# Altium schematic sheet SimPL_IMU_v1_0 _OCT31.SchDoc
size C
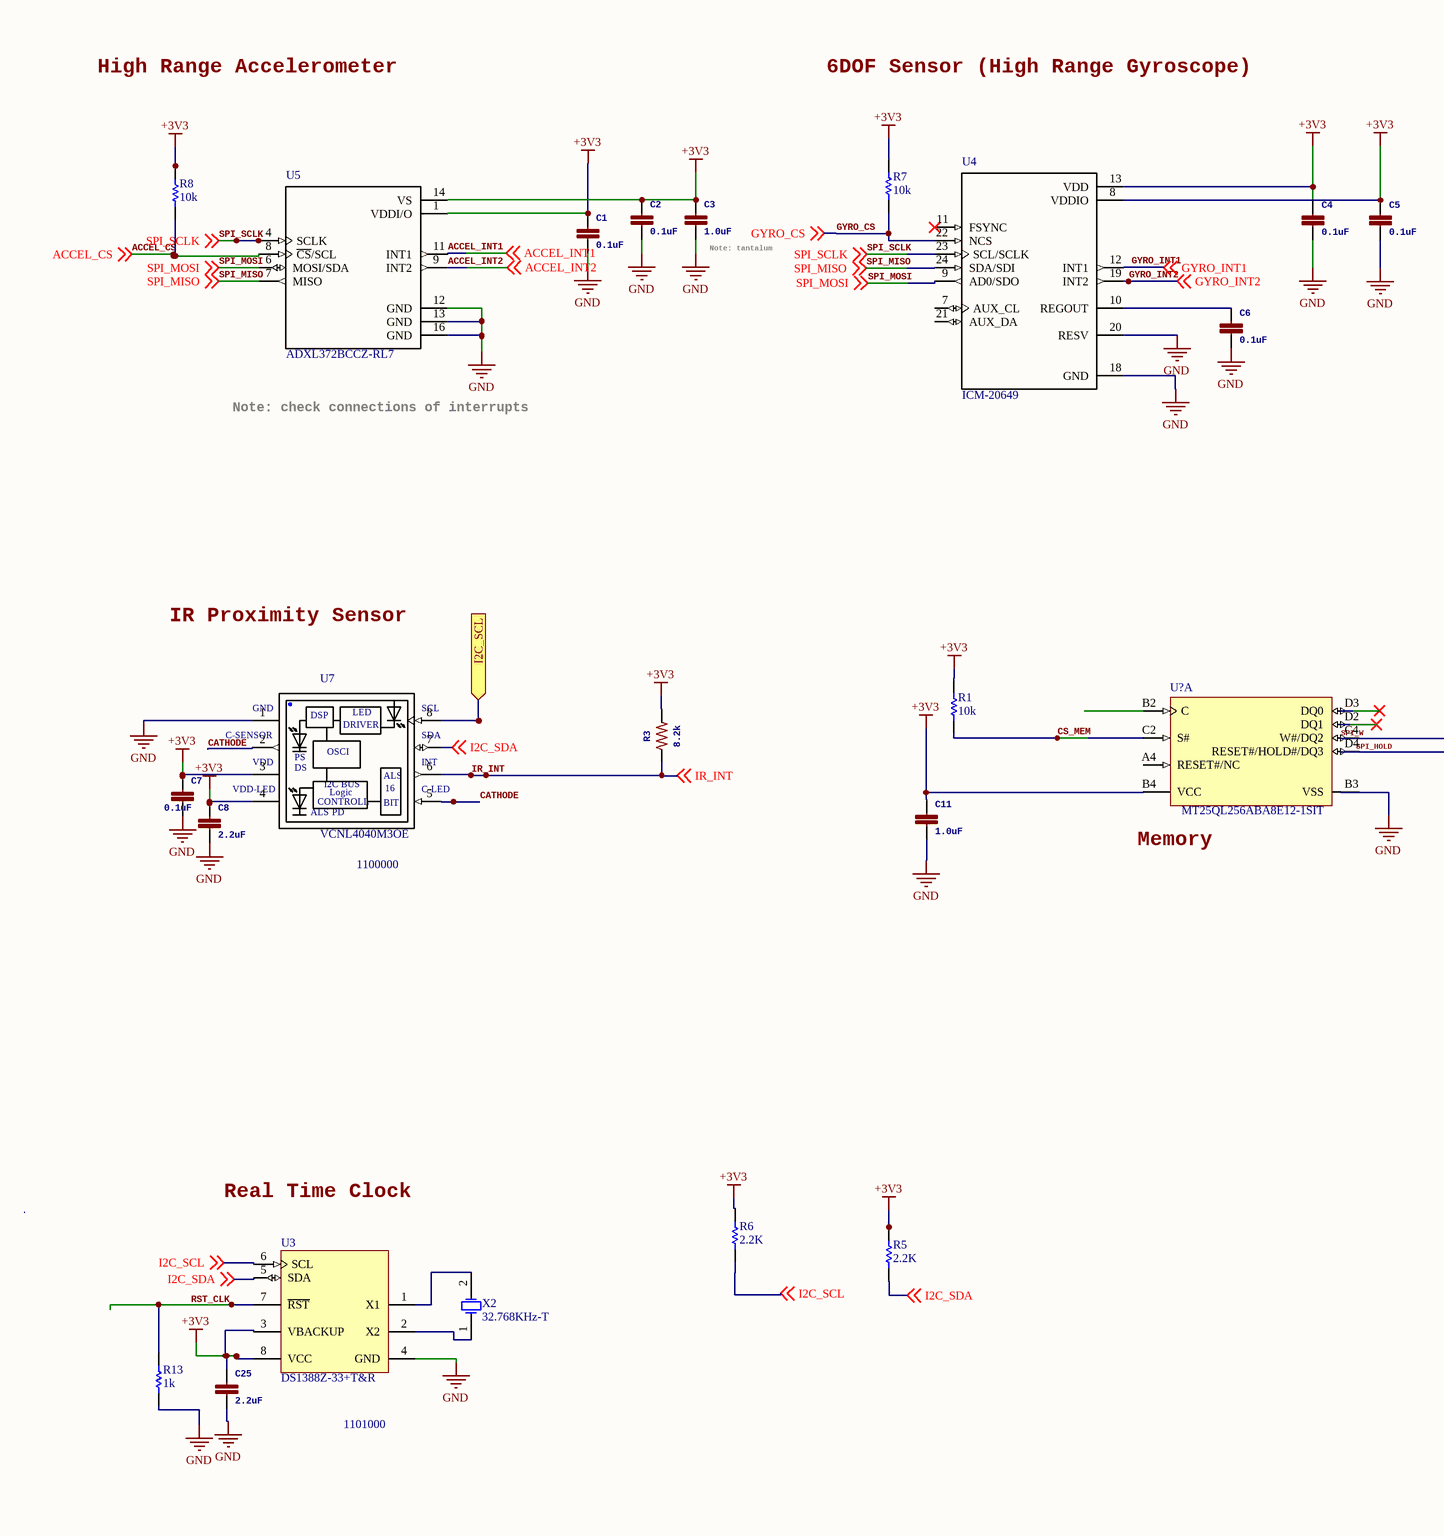
[diagram p0: SimPL_IMU_v1_0 _OCT31.SchDoc, left]
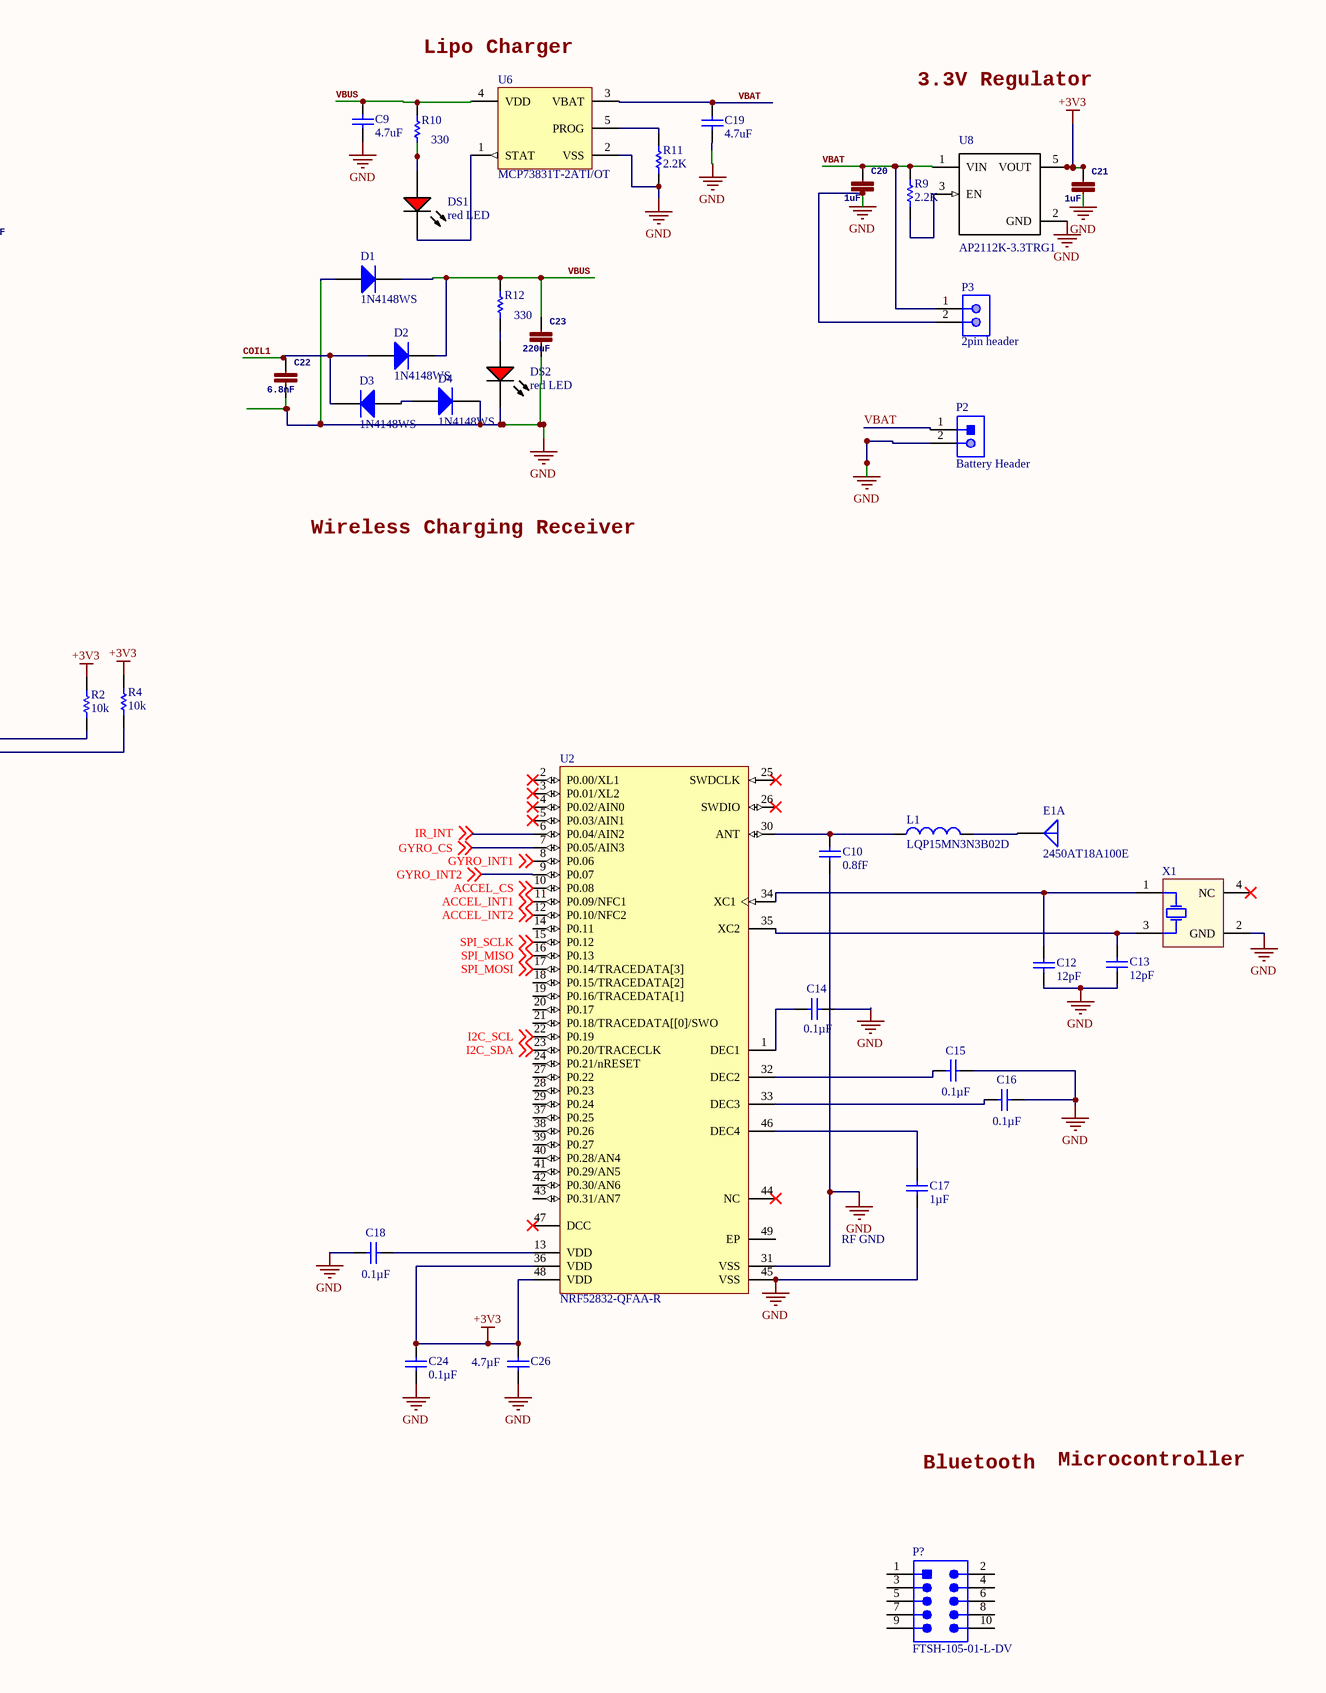
[diagram p1: SimPL_IMU_v1_0 _OCT31.SchDoc, right]

## Parts
C1  0.1uF  [0402]
C2  0.1uF  [0402]
C3  1.0uF  [0402]
C4  0.1uF  [0402]
C5  0.1uF  [0402]
C6  0.1uF  [0402]
C7  0.1uF  [0402]
C8  2.2uF  [0402]
C9  4.7uF  [CAPC1005X65X10ML15]
C10  value 0.8fF  [CAPC0603X28X15LL05T05]  (hidden comment: 02013J0R8BBSTR)
C11  1.0uF  [0402]
C12  value 12pF  [CAPC0402(1005)60_N]  (hidden comment: CAP 12pF 16V 0402(1005))
C13  value 12pF  [CAPC0402(1005)60_N]  (hidden comment: CAP 12pF 16V 0402(1005))
C14  Capacitance: 0.1µF  [CAPC1005X55X10LL05]  (hidden comment: CGA2B3X7R1E104K050BB)
C15  Capacitance: 0.1µF  [CAPC1005X55X10LL05]  (hidden comment: CGA2B3X7R1E104K050BB)
C16  Capacitance: 0.1µF  [CAPC1005X55X10LL05]  (hidden comment: CGA2B3X7R1E104K050BB)
C17  Capacitance: 1µF  [CAPC1005X55X10LL05]  (hidden comment: C1005X5R1V105K050BC)
C18  Capacitance: 0.1µF  [CAPC1005X55X10LL05]  (hidden comment: CGA2B3X7R1E104K050BB)
C19  4.7uF  [CAPC1005X65X10ML15]
C20  1uF  [0402]
C21  1uF  [0402]
C22  6.8nF  [0402]
C23  220uF  [0402]
C24  Capacitance: 0.1µF  [CAPC1005X55X10LL05]  (hidden comment: CGA2B3X7R1E104K050BB)
C25  2.2uF  [0402]
C26  Capacitance: 4.7µF  [CAPC1005X65X10ML15]  (hidden comment: C1005X5R1A475M050BC)
D1  1N4148WS  [DIOD-SOD323-2-A_V]
D2  1N4148WS  [DIOD-SOD323-2-A_V]
D3  1N4148WS  [DIOD-SOD323-2-A_V]
D4  1N4148WS  [DIOD-SOD323-2-A_V]
DS1  red LED  [VISH-TLMS1000_V]
DS2  red LED  [VISH-TLMS1000_V]
E1  2450AT18A100E  [JT-2450AT18A100-2_V]  (part A of 2)
L1  LQP15MN3N3B02D  [INDC1005X45X25LL10T10]
P2  Battery Header  [JST-S2B-PH-K-S_V]
P3  2pin header  [AMPH-68000-102HLF_V]
P?  FTSH-105-01-L-DV  [SMTC-FTSH-105-01-L-DV_V]
R1  10k  [RESC1005X40X25NL05T05]
R2  10k  [RESC1005X40X25NL05T05]
R3  8.2k  [0603]
R4  10k  [RESC1005X40X25NL05T05]
R5  2.2K  [RESC1005X40X25ML10T10]
R6  2.2K  [RESC1005X40X25ML10T10]
R7  10k  [RESC1005X40X25NL05T05]
R8  10k  [RESC1005X40X25NL05T05]
R9  2.2K  [RESC1005X40X25ML10T10]
R10  330  [RESC2013X50X30NL20T20]
R11  2.2K  [RESC1005X40X25ML10T10]
R12  330  [RESC2013X50X30NL20T20]
R13  1k  [RESC1005X40X25NL05T05]
U2  NRF52832-QFAA-R  [NRSC-QF-48_M]
U3  DS1388Z-33+T&R  [S8+4_M]
U4  ICM-20649  [*QFN40P300X300X95-24N]
U5  ADXL372BCCZ-RL7  [*PQFN50P322X300X114-16N]
U6  MCP73831T-2ATI/OT  [SOT-23-OT5_M]
U7  VCNL4040M3OE  [*VISHAY_VCNL4040_4X2X1.1]
U8  AP2112K-3.3TRG1  [*SOT95P285X140-5N]
U?  MT25QL256ABA8E12-1SIT  [*SON127P600X800X80-9N]  (part A of 2)
X1  CX2520DB32000D0GEJZ1  [AVX-CX2520DB32000D0GEJZ1-4_V]  (value not drawn)
X2  32.768KHz-T  [ABRA-ABS07-2_V]

## Ports
I2C_SCL (in)

## Nets
+3V3: C1.1 C2.1 C3.1 C4.1 C5.1 C7.1 C8.1 C11.1 C21.1 C24.2 C25.1 C26.2 R1.2 R2.2 R3.2 R4.2 R5.2 R6.2 R7.2 R8.2 U2.36(VDD) U2.48(VDD) U3.3(VBACKUP) U3.8(VCC) U4.8(VDDIO) U4.13(VDD) U5.1(VDDI/O) U5.14(VS) U7.3(VDD) U7.4(VDD-LED) U8.5(VOUT) U?.B4(VCC)
GND: C1.2 C2.2 C3.2 C4.2 C5.2 C6.2 C7.2 C8.2 C9.1 C10.1 C11.2 C12.1 C13.1 C14.2 C15.2 C16.2 C17.1 C18.1 C19.1 C20.2 C21.2 C22.2 C23.2 C24.1 C25.2 C26.1 D1.1(A) D4.2(K) DS2.2(K) P2.2 P3.2 R11.1 R13.1 U2.31(VSS) U2.45(VSS) U3.4(GND) U4.18(GND) U4.20(RESV) U5.12(GND) U5.13(GND) U5.16(GND) U6.2(VSS) U7.1(GND) U8.2(GND) X1.2(GND)
ACCEL_CS: R8.1 U2.10(P0.08) U5.8(~{CS}/SCL) ; off-sheet ACCEL_CS
ACCEL_INT1: U2.11(P0.09/NFC1) U5.11(INT1) ; off-sheet ACCEL_INT1
ACCEL_INT2: U2.12(P0.10/NFC2) U5.9(INT2) ; off-sheet ACCEL_INT2
CATHODE: U7.2(C-SENSOR) U7.5(C-LED)
COIL1: C22.1 D2.1(A) D3.2(K)
CS_MEM: R1.1 U?.C2(S#)
GYRO_CS: R7.1 U2.7(P0.05/AIN3) U4.22(NCS) ; off-sheet GYRO_CS
GYRO_INT1: U2.8(P0.06) U4.12(INT1) ; off-sheet GYRO_INT1
GYRO_INT2: U2.9(P0.07) U4.19(INT2) ; off-sheet GYRO_INT2
I2C_SCL: U7.8(SCL) ; port I2C_SCL
I2C_SCL: R6.1 U2.22(P0.19) U3.6(SCL) ; off-sheet I2C_SCL  [a separate net that carries the same name]
I2C_SDA: R5.1 U2.23(P0.20/TRACECLK) U3.5(SDA) U7.7(SDA) ; off-sheet I2C_SDA
IR_INT: R3.1 U2.6(P0.04/AIN2) U7.6(INT) ; off-sheet IR_INT
SPI_HOLD: R4.1
SPI_MISO: U2.16(P0.13) U4.24(SDA/SDI) U5.7(MISO) ; off-sheet SPI_MISO
SPI_MOSI: U2.17(P0.14/TRACEDATA[3]) U4.9(AD0/SDO) U5.6(MOSI/SDA) ; off-sheet SPI_MOSI
SPI_SCLK: U2.15(P0.12) U4.23(SCL/SCLK) U5.4(SCLK) ; off-sheet SPI_SCLK
SPI_W: R2.1
VBAT: C19.2 C20.1 P2.1 P3.1 R9.2 U6.3(VBAT) U8.1(VIN)
VBUS: C9.2 C23.1 D1.2(K) D2.2(K) R10.2 R12.2 U6.4(VDD)
NetC6_1: C6.1 U4.10(REGOUT)
NetC10_2: C10.2 L1.1 U2.30(ANT)
NetC12_2: C12.2 U2.34(XC1) X1.1(HOT)
NetC13_2: C13.2 U2.35(XC2) X1.3(HOT)
NetC14_1: C14.1 U2.1(DEC1)
NetC15_1: C15.1 U2.32(DEC2)
NetC16_1: C16.1 U2.33(DEC3)
NetC17_2: C17.2 U2.46(DEC4)
NetC18_2: C18.2 U2.13(VDD)
NetD3_1: D3.1(A) D4.1(A)
NetDS1_1: DS1.1(A) R10.1
NetDS1_2: DS1.2(K) U6.1(STAT)
NetDS2_1: DS2.1(A) R12.1
NetE1_1: E1.1(FP) L1.2
NetR9_1: R9.1 U8.3(EN)
NetR11_2: R11.2 U6.5(PROG)
NetR13_2: R13.2 U3.7(~{RST})
NetU3_1: U3.1(X1) X2.2(X2)
NetU3_2: U3.2(X2) X2.1(X2)

Not connected (* = marked no-connect by the designer): P? 1 2 3 4 5 6 7 8 9 10; U2 2(P0.00/XL1)* 3(P0.01/XL2)* 4(P0.02/AIN0)* 5(P0.03/AIN1)* 14(P0.11) 18(P0.15/TRACEDATA[2]) 19(P0.16/TRACEDATA[1]) 20(P0.17) 21(P0.18/TRACEDATA[[0]/SWO) 24(P0.21/nRESET) 25(SWDCLK)* 26(SWDIO)* 27(P0.22) 28(P0.23) 29(P0.24) 37(P0.25) 38(P0.26) 39(P0.27) 40(P0.28/AN4) 41(P0.29/AN5) 42(P0.30/AN6) 43(P0.31/AN7) 44(NC)* 47(DCC)* 49(EP); U4 7(AUX_CL) 11(FSYNC)* 21(AUX_DA); U? A4(RESET#/NC) B2(C) B3(VSS) C4(W#/DQ2) D2(DQ1)* D3(DQ0)* D4(RESET#/HOLD#/DQ3); X1 4(NC)*

## Notes on the sheet
- High Range Accelerometer
- 6DOF Sensor (High Range Gyroscope)
- Lipo Charger
- 3.3V Regulator
- (near C3) Note: tantalum
- Note: check connections of interrupts
- Wireless Charging Receiver
- IR Proximity Sensor
- 1100000
- (near U?) Memory
- Real Time Clock
- RF GND
- 1101000
- Bluetooth
- Microcontroller
- Labels drawn without touching a wire or pin: RST_CLK
- (in symbol VCNL4040M3OE) LED; DSP; DRIVER; OSCI; PS; DS; ALS; I2C BUS; Logic; 16; CONTROLL; BIT; PD

## Library data of the parts
C1 C2 C4-C7 = 0.1UF-0402-16V-10%: 0.1ÂµF ceramic capacitors    A capacitor is a passive two-terminal electrical component used to store electrical energy temporarily in an electric field.; GateName_1: G$1; SymbolName_1: CAP; PROD_ID: CAP-12416; DeviceName: -0402-16V-10%; LibraryName: SparkFun-Capacitors; DeviceSetName: 0.1UF
C3 = 1.0UF-0402-16V-10%: 1ÂµF ceramic capacitors    A capacitor is a passive two-terminal electrical component used to store electrical energy temporarily in an electric field.; GateName_1: G$1; SymbolName_1: CAP; PROD_ID: CAP-12417; DeviceName: -0402-16V-10%; LibraryName: SparkFun-Capacitors; DeviceSetName: 1.0UF
C8 C20-C23 C25 = 0.1UF-0402-16V-10%: 0.1ÂµF ceramic capacitors    A capacitor is a passive two-terminal electrical component used to store electrical energy temporarily in an electric field.; GateName_1: G$1; SymbolName_1: CAP; DeviceSetName: 0.1UF; PROD_ID: CAP-12416; DeviceName: -0402-16V-10%; LibraryName: SparkFun-Capacitors
C9 C19 = CMP-2000-05438-1: Chip Capacitor, 4.7 uF, +/- 20%, 10 V, -55 to 85 degC, 0402 (1005 Metric), RoHS, Tape and Reel; PCN Part Number: MLCCPartNumberChange30/Nov/2012; Manufacturer: TDK; Other Names: 445-8023-1; Voltage - Rated: 10V; Temperature Coefficient: X5R; Online Catalog: CSeries,GeneralPurpose; Capacitance: 4.7µF; Kits: 445-9021-KIT-ND-KITMLCC100PF-10UF04026.3-50V445-9003-KIT-ND-KITCAPCERHICAPMLCCSMD; Product Training Modules: CSeriesGeneralApplicationsSEAT,CCV,andTVCLDesignToolsGuidetoReplacinganElectrolyticCapacitorwithanMLCC; Lead Style: -; Datasheet Version: Sep-13; Category: Capacitors; Operating Temperature: -55degC~85degC; Applications: GeneralPurpose; Standard Package: 1; RoHS Information: RoHSCertificate-MLCC; Series: C; Datasheet URL: https://datasheet.ciiva.com/24216/c1005x5r1a475m050bc-264317-24216438.pdf; Package / Case: 0402(1005Metric); Mounting Type: SurfaceMount,MLCC; Ratings: -; Tolerance: ±20%; Lead Spacing: -; Height - Seated (Max): -; Manufacturer URL: http://www.tdk.com/; Size / Dimension: 0.039"Lx0.020"W(1.00mmx0.50mm); Packaging: CutTape(CT); Family: CeramicCapacitors; Features: -; Thickness (Max): -
C10 = CMP-2010-00085-1: Manufacturer: AVX Interconnect / Elco; Part Number: 02013J0R8BBSTR
C11 = 1.0UF-0402-16V-10%: 1?¦ÌF ceramic capacitors    A capacitor is a passive two-terminal electrical component used to store electrical energy temporarily in an electric field.; GateName_1: G$1; SymbolName_1: CAP; PROD_ID: CAP-12417; DeviceName: -0402-16V-10%; LibraryName: SparkFun-Capacitors; DeviceSetName: 1.0UF
C12 C13 = CMP-1034-00757-1: CAP 12pF 16V ±5% 0402 (1005 Metric) Thickness 0.6mm SMD; Tolerance: Â±5%; Case-EIA: 0402; Case-Metric: 1005; Rated Voltage: 16 V; Technology: SMT; Max Thickness: 0.6 mm
C14-C16 C18 C24 = CMP-2000-06086-1: Chip Capacitor, 100 nF, +/- 10%, 25 V, -55 to 125 degC, 0402 (1005 Metric), RoHS, Tape and Reel; Manufacturer: TDK; PCN Part Number: MLCCPartNumberChange30/Nov/2012; Product Training Modules: CGASeriesforAutomotiveApplicationsSEAT,CCV,andTVCLDesignToolsGuidetoReplacinganElectrolyticCapacitorwithanMLCC; Featured Product: CGASeriesMLCCCapacitors; Other Names: 445-6902-6; Voltage - Rated: 25V; Temperature Coefficient: X7R; Online Catalog: CGASeries,AutomotiveGeneral,MidandHighVoltage; Lead Spacing: -; Datasheet Version: 01/2016; Standard Package: 1; Applications: Automotive; Package Description: 2-Pin Surface Mount Device, Body 1 x 0.5 mm; Family: CeramicCapacitors; Tolerance: ±10%; Mounting Technology: SurfaceMount; Series: CGA; Datasheet URL: https://product.tdk.com/info/en/documents/chara_sheet/CGA2B3X7R1E104K050BB.pdf; Mounting Type: SurfaceMount,MLCC; Size / Dimension: 0.039"Lx0.020"W(1.00mmx0.50mm); Manufacturer URL: http://www.tdk.com/; Lead Style: -; Thickness (Max): 0.022"(0.55mm); Package / Case: 0402(1005Metric); Height - Seated (Max): -; RoHS Information: RoHSCertificate-MLCC; Ratings: AEC-Q200; Category: Capacitors; Packaging: Digi-Reel®; Package Reference: 1005; Features: -; Operating Temperature: -55°C~125°C
C17 = CMP-2000-06004-1: Chip Capacitor, 1 uF, +/- 10%, 35 V, -55 to 85 degC, 0402 (1005 Metric), RoHS, Tape and Reel; PCN Part Number: MLCCPartNumberChange30/Nov/2012; Manufacturer: TDK; Other Names: 445-9073-1; Voltage - Rated: 35V; Temperature Coefficient: X5R; Product Training Modules: SEAT,CCV,andTVCLDesignToolsGuidetoReplacinganElectrolyticCapacitorwithanMLCC; Kits: 445-9021-KIT-ND-KITMLCC100PF-10UF04026.3-50V; Online Catalog: CSeries,GeneralPurpose; Thickness (Max): 0.022"(0.55mm); Applications: GeneralPurpose; Height - Seated (Max): -; Mounting Technology: SurfaceMount; Manufacturer URL: http://www.tdk.com/; Standard Package: 1; Size / Dimension: 0.039"Lx0.020"W(1.00mmx0.50mm); Lead Style: -; Lead Spacing: -; Packaging: CutTape(CT); Family: CeramicCapacitors; Category: Capacitors; Tolerance: ±10%; Operating Temperature: -55°C~85°C; Ratings: -; RoHS Information: RoHSCertificate-MLCC; Package Description: 2-Pin Surface Mount Device, Body 1 x 0.5 mm; Datasheet Version: 08/2016; Mounting Type: SurfaceMount,MLCC; Features: -; Package Reference: 1005; Package / Case: 0402(1005Metric); Datasheet URL: https://product.tdk.com/info/en/catalog/datasheets/mlcc_commercial_general_en.pdf; Series: C
C26 = CMP-2000-05438-1: Chip Capacitor, 4.7 uF, +/- 20%, 10 V, -55 to 85 degC, 0402 (1005 Metric), RoHS, Tape and Reel; PCN Part Number: MLCCPartNumberChange30/Nov/2012; Manufacturer: TDK; Other Names: 445-8023-1; Voltage - Rated: 10V; Temperature Coefficient: X5R; Online Catalog: CSeries,GeneralPurpose; Kits: 445-9021-KIT-ND-KITMLCC100PF-10UF04026.3-50V445-9003-KIT-ND-KITCAPCERHICAPMLCCSMD; Product Training Modules: CSeriesGeneralApplicationsSEAT,CCV,andTVCLDesignToolsGuidetoReplacinganElectrolyticCapacitorwithanMLCC; Lead Style: -; Datasheet Version: Sep-13; Category: Capacitors; Operating Temperature: -55degC~85degC; Applications: GeneralPurpose; Standard Package: 1; RoHS Information: RoHSCertificate-MLCC; Series: C; Datasheet URL: https://datasheet.ciiva.com/24216/c1005x5r1a475m050bc-264317-24216438.pdf; Package / Case: 0402(1005Metric); Mounting Type: SurfaceMount,MLCC; Ratings: -; Tolerance: ±20%; Lead Spacing: -; Height - Seated (Max): -; Manufacturer URL: http://www.tdk.com/; Size / Dimension: 0.039"Lx0.020"W(1.00mmx0.50mm); Packaging: CutTape(CT); Family: CeramicCapacitors; Features: -; Thickness (Max): -
D1-D4 = CMP-1667-00004-1: Fast Switching Diode, 75 V, 0.3 A, -65 to 150 degC, 2-Pin SOD323, RoHS, Tape and Reel; DatasheetVersion: Rev. 25-2, 03/2016; PackageDescription: 2-Pin Small Outline Diode, Body 1.7 x 1.3 mm; ComponentLink2Description: Datasheet; ComponentLink1URL: http://www.diodes.com/; PackageReference: SOD323-2; ComponentLink2URL: http://www.diodes.com/datasheets/ds30097.pdf; ComponentLink1Description: Manufacturer URL
DS1 DS2 = CMP-2000-07254-1: Low Current LED, 40 mW, 1.8 V, -40 to 100 degC, 2-Pin SMD (0603), RoHS, Tape and Reel; Manufacturer: Vishay; Lens Shape: Rectangular; Automotive Qualification Standard: AEC-Q100; Wavelength Typ: 636nm; SVHC: ToBeAdvised; Bulb Size: 1.6mmx0.8mm; Forward Voltage: 1.8V; Luminous Intensity: 4mcd; Forward Current If: 2mA; Viewing Angle: 80°; Datasheet Version: Rev. 1.7, 02/2011; Datasheet URL: https://datasheet.ciiva.com/5798/1698881-5798337.pdf; LED Mounting: SMD; Packaging: CutTape; Package Reference: TLMS1000; Manufacturer URL: http://www.vishay.com/; Mounting Technology: SurfaceMount; Product Range: -; LED Colour: Red; Package Description: 2-Pin Surface Mount Device, Body 1.6 x 0.8 mm; MSL: MSL2-1year
E1 = CMP-2000-05167-1: Ceramic Antenna, 2.45 GHZ, 2 W, -40 to 125 degC, 2-Pin SMD, RoHS, Tape and Reel; Manufacturer: Johanson Technology; Maximum Frequency: 2500MHz; Typical Antenna Gain: 0.5dB; Minimum Frequency: 2400MHz; Manufacturer URL: https://www.johansontechnology.com/; Type: Ceramic; Datasheet Version: Rev. 1.3, 07/2014; Category: Antenna; Package: 2Case18-4; Datasheet URL: http://www.johansontechnology.com/datasheets/antennas/2450AT18A100.pdf
L1 = CMP-2000-06591-1: Chip Inductor, 3.3 nH, +/- 0.1 nH, 190 mA, -40 to 85 degC, 0402 (1005 Metric), RoHS, Tape and Reel; Manufacturer: Murata; Rated Current-Max: 190mA; Tolerance (nH): ±0.1nH; DC Resistance: 0.4O; Inductance-Nom: 3.3nH; Datasheet Version: 09/2010; Package Reference: 0402; Datasheet URL: http://search.murata.co.jp/Ceramy/image/img/PDF/ENG/L0075S0084LQP15M.pdf; Manufacturer URL: http://www.murata.com/; Package Description: 2-Pin Surface Mount Device, Body 1 x 0.5 mm; Mounting Technology: SurfaceMount; Case Size/Dimension: 0402
P2 = CMP-1755-00004-1: Male Header, Pitch 2 mm, 1 x 2 Position, Height 4.8 mm, Tail Length 3.4 mm, -25 to 85 degC, RoHS, Bulk; Case\Package: Radial; Tolerance: 20%; Capacitance: 10 uF; Voltage Rating (DC): 50 V; Packaging: Bulk; ComponentLink1URL: http://www.jst-mfg.com/product/pdf/eng/ePH.pdf; Radiation Hardening: No; Height: 11 mm; Package Quantity: 200; PackageDescription: Male Header, Pitch 2 mm, 1 x 2 Position, Height 4.8 mm, Tail Length 3.4 mm; PackageReference: S2B-PH-K-S; Diameter: 5 mm; Pins: 2; Mount: Through Hole; Max Operating Temperature: 85 degC; Min Operating Temperature: -40 degC; ComponentLink1Description: Datasheet; DatasheetVersion: Dec-12; Length: 11 mm; Lead Pitch: 2 mm; REACH SVHC: No SVHC; Voltage Rating: 50 V; RoHSCompliant: true
P3 = CMP-2000-05666-1: Male Header, Pitch 2.54 mm, 1 x 2 Position, Height 8.38 mm, Tail Length 2.41 mm, RoHS, Bulk; Number of Positions: 2; Insulation Resistance: 5000MOhms; Voltage Rating: 1.5kV; Mounting Angle: Vertical; Pitch: 2.54mm; Brand: FCI; Current Rating: 3A; Mating Post Length: 5.84mm; Operating Temperature Range: -65Cto+125C; Product Category: Headers&WireHousings; Datasheet URL: https://datasheet.ciiva.com/5149/68000-274228-5149165.pdf; Number of Positions / Contacts: 2; Contact Gender: Pin(Male); Packaging: Bulk; Mounting Technology: ThroughHole; Product Type: Headers; Housing Material: Thermoplastic; Contact Material: PhosphorBronze; Contact Plating: Gold/GTX; Package Description: Male Header, Pitch 2.54 mm, 1 x 2 Position, Height 8.38 mm, Tail Length 2.41 mm; Package Reference: 68000-102HLF; Type: Unshrouded; Factory Pack Quantity: 100; Termination Style: ThroughHole; RoHS: Details; Series: 68000; Mounting Style: ThroughHole; Flammability Rating: UL94V-0; Number of Rows: 1; Manufacturer: FCI; Termination Post Length: 2.41mm; Manufacturer URL: http://www.amphenol.com/; Datasheet Version: Rev. F, 04/2006
P? = CMP-2000-05354-1: Male Header, Pitch 1.27 mm, 2 x 5 Position, Height 5.96 mm, -55 to 125 degC, RoHS, Bulk; Manufacturer: Samtec; Connector Type: Header,Unshrouded; Pitch: 0.050"(1.27mm); Mating Products: FLE-105-01-G-DV-TR-ND-CONNSKT1.27MM10POSDUALSMDCLP-105-02-G-D-P-TR-ND-CONNRCPT10POSDUAL.05"SMDSFMC-105-L2-S-D-TR-ND-CONN.05"SURFACE10POSSMTSFMH-105-02-L-D-TR-ND-CONNRECEPT10POS.50"SMTFLE-105-01-G-DV-A-ND-CONNSKT1.27MM10POSDUALSMDCLP-105-02-G-D-BE-ND-CONNRCPT10POSDUAL.05"SMDFLE-105-01-G-DV-A-P-ND-CONNSKT1.27MM10POSDUALSMDSAM1153-05-ND-CONNRCPT10POSDUAL.05"SMDSAM1155-05-ND-CONNRCPT10POSDUAL.05"SMDSAM1154-05-ND-CONNRCPT10POSDUAL.05"SMDSFMH-105-02-L-D-LC-ND-CONNRECEPT10POS.50"SMTSAM1226-05-ND-CONNRCPT.05"10POSDUALSMD; Catalog Drawings: FTSHSeriesFTSHSeriesSMTSide; Other Names: SAM1161-05; EDA / CAD Models: DownloadfromAcceleratedDesigns; Number of Positions Loaded: All; Number of Positions: 10; Featured Product: Board-To-BoardInterconnectSystems; Online Catalog: FTSHSeries; Product Training Modules: Board-to-BoardConnectors; Category: Connectors,Interconnects; Number of Rows: 2; Contact Finish: Gold; Termination: Solder; Mounting Type: SurfaceMount; Series: FTSH; Contact Mating Length: 0.120"(3.05mm); Row Spacing: 0.050"(1.27mm); Datasheet URL: https://datasheet.ciiva.com/30493/0900766b80adfe36-30493006.pdf; Contact Finish Thickness: 10µin(0.25µm); Features: -; Standard Package: 1; Packaging: Bulk; Datasheet Version: Feb-08; Manufacturer URL: http://www.samtec.com/; Fastening Type: -; Family: RectangularConnectors-Headers,MalePins; Contact Type: MalePin; Color: Black
R1 R2 R4 R7 R8 = CMP-2002-00607-3: Chip Resistor, 10 KOhm, +/- 1%, 100 mW, -55 to 155 degC, 0402 (1005 Metric), RoHS, Tape and Reel; Manufacturer: Basic Passives; PartNumber: ERJ-2RKF1002X; Case\/Package: 0402; Resistance: 10 KOhm; Voltage Rating: 50 V; Power Rating: 100 mW; Packaging: Tape and Reel; Width: 0.5 mm; Package Quantity: 10000; Radiation Hardening: No; Min Operating Temperature: -55 degC; Case Code (Imperial): 0402; REACH SVHC: Yes; PackageDescription: 2-Pin Surface Mount Device, Body 1 x 0.5 mm; Length: 1 mm; ComponentLink1Description: Manufacturer URL; PackageReference: 0402; RoHSCompliant: true; ComponentLink1URL: http://www.panasonic.com/; Height: 0.35 mm; ComponentLink2Description: Datasheet; DatasheetVersion: 04/2015; Mounting Technology: Surface Mount; ComponentLink2URL: http://industrial.panasonic.com/cdbs/www-data/pdf/RDA0000/AOA0000C86.pdf; Max Operating Temperature: 155 degC; Pins: 2; Tolerance: 1%; Case Code (Metric): 1005; Mount: Surface Mount
R3 = 8.2KOHM-0603-1/10W-5%: 8.2kÎ© resistor    A resistor is a passive two-terminal electrical component that implements electrical resistance as a circuit element. Resistors act to reduce current flow, and, at the same time, act to lower voltage levels within circuits. - Wikipedia; GateName_1: G$1; PROD_ID: RES-10646; SymbolName_1: RESISTOR; DeviceName: -0603-1/10W-5%; LibraryName: SparkFun-Resistors; DeviceSetName: 8.2KOHM
R5 R6 R9 R11 = CMP-2002-06097-1: Part Number: MC00625W040212K2; Manufacturer: Multicomp
R10 R12 = CMP-2001-03823-1: Manufacturer: Vishay Dale; Part Number: CRCW0805330RFKEA
R13 = CMP-2002-08276-1: Manufacturer: Vishay Dale; Part Number: CRCW04021K00FKED
U2 = CMP-2100-03661-1: Multiprotocol Bluetooth Smart, ANT/ANT+ and Proprietary System-on-Chip, 2.4 GHz, 256 KB FLASH, 1.7 to 3.6 V, -40 to 85 degC, 48-Pin QFN, RoHS, Tape and Reel; Manufacturer: Nordic Semiconductor; Frequency: 2.4GHz; Datasheet Version: Rev. 1.0, 02/2016; Datasheet URL: http://infocenter.nordicsemi.com/pdf/nRF52832_PS_v1.0.pdf; Mount: SurfaceMount; Max Operating Temperature: 85degC; Manufacturer URL: http://www.nordicsemi.com/eng/Products/; Lead Free: LeadFree; Min Operating Temperature: -40degC; RoHSCompliant: true; Package Reference: QF-48; Package Description: 48-Pin Quad Flat No-lead Package, Body 6 x 6 mm, Pitch 0.4 mm, Thermal Pad 4.6 x 4.6 mm; Max Frequency: 2.4GHz; Packaging: TapeandReel
U3 = CMP-0254-00385-1: I2C Real-Time Clock/Supervisor with Trickle Charger and 512 Byte EEPROM, 3.3V, 8-Pin SO, -40 to 85 degC, Pb-Free, Reel; Code_IPC: SOIC127P600-8; ComponentLink3URL: http://pdfserv.maxim-ic.com/package_dwgs/21-0041.PDF; ComponentLink1URL: http://www.maxim-ic.com; ComponentLink2Description: Datasheet; PackageVersion: revC, 2010; ComponentLink1Description: Manufacturer URL; DatasheetVersion: rev3, Aug-2010; PackageReference: S8+4; ComponentLink2URL: http://datasheets.maxim-ic.com/en/ds/DS1388.pdf; PackageDescription: 8-Pin Small-Outline IC, Narrow (0.15in), 1.27 mm Pitch, SOIC (N), Pb-Free; Code_JEDEC: MS-012-AA; ComponentLink3Description: Package Specification
U4 = ICM-20649: Wide-Range 6-Axis MEMS MotionTracking Device for Sports and High Impact Applications; MF: TDK InvenSense; MP: ICM-20649; Price: None; SnapEDA_Link: https://www.snapeda.com/parts/ICM-20649/TDK%20InvenSense/view-part/?ref=snap; Package: QFN-24 InvenSense; Availability: Unavailable; Value: *
U5 = ADXL372BCCZ-RL7: / Accelerometer Triple Â±200g 2.5V 16-Pin LGA T/R /; MF: Analog Devices; SnapEDA_Link: https://www.snapeda.com/parts/ADXL372BCCZ-RL7/Analog%20Devices%20Inc./view-part/?ref=snap; Availability: Unavailable; Price: None; MP: ADXL372BCCZ-RL7; Package: LGA-16 Analog Devices; Value: *
U6 = CMP-0133-00144-1: Miniature Single-Cell, Fully Integrated Li-Ion, Li-Polymer Charge Management Controller, 4.2V, 5-Pin SOT-23, Industrial Temperature, Tape and Reel; DatasheetVersion: revE, Sep-2008; PackageVersion: revBB, Aug-2009; PackageReference: SOT-23-OT5; PackageDescription: 5-Lead Plastic Small Outline Transistor (OT) [SOT-23]; Code_IPC: SOT23-5
U7 = VCNL4040M3OE: VCNL4040 Series 3.6 V 200 mm 16 Bit I2C SMT Proximity and Ambient Light Sensor; MF: Vishay; SnapEDA_Link: https://www.snapeda.com/parts/VCNL4040M3OE/Vishay%20Semiconductor%20Opto%20Division/view-part/?ref=snap; Availability: Unavailable; Price: None; MP: VCNL4040M3OE; Package: SMD-8 Vishay; Value: *
U8 = AP2112K-3.3TRG1: AP2112 Series 0.6 A 3.3 V Fixed Output SMT LDO Linear Regulator - SOT23-5; MF: Diodes Inc.; Availability: Unavailable; Package: SOT-753 Diodes Inc.; Price: None; SnapEDA_Link: https://www.snapeda.com/parts/AP2112K-3.3TRG1/Diodes%20Inc./view-part/?ref=snap; MP: AP2112K-3.3TRG1; Value: *
U? = CMP-2000-07528-1: Micron Serial NOR Flash Memory, 256 Mbits, 2.7 to 3.6 V, -40 to 85 degC, 24-Pin T-PBGA (12), RoHS; Datasheet URL: https://www.micron.com/~/media/documents/products/data-sheet/nor-flash/serial-nor/mt25q/die-rev-a/mt25q_qljs_l_256_aba_0.pdf; Manufacturer URL: http://www.micron.com/; RoHSCompliant: true; Datasheet Version: Rev. I, 07/2017; Mounting Technology: SurfaceMount; Package Reference: 12-24; Package Description: 24-Ball Plastic Ball Grid Array, Body 8 x 6 mm, Pitch 1 mm; Manufacturer: Micron
X1 = CMP-0449-00001-2: Crystal, 32 MHz, 8 pF, -10 to 70 degC, Surface Mount 2.5 x 2.0 mm; Manufacturer: Kyocera; Load Capacitance: 8 pF; Frequency Range: 32000 kHz; Packing: Tape and Reel; Motional Series Resistance: 50 ohm (max); Drive Level: 10uW (100uW max.); ComponentLink3Description: Package Specification; ComponentLink1Description: Manufacturer URL; ComponentLink2Description: Datasheet; PackageDescription: 4-Pin Hand Drawnï¼ŒBody 2.5x2mm; ComponentLink1URL: http://global.kyocera.com/; ComponentLink3URL: http://global.kyocera.com/prdct/electro/pdf/xtal/cx2520db_cs_e.pdf; Operating Temperature: -10 to 70 degC; ComponentLink2URL: http://global.kyocera.com/prdct/electro/pdf/xtal/cx2520db_cs_e.pdf; PartNumber: CX2520DB32000D0GEJZ1; PackageReference: CX2520DB32000D0GEJZ1-4; Mounting Technology: Surface Mount
X2 = CMP-0447-00001-2: Crystal, 32.768 kHz, 12.5 pF, -40 to 85 degC, SMD Low Profile 3.2 x 1.5 x 0.9 mm, Tape and Reel; Manufacturer: Abracon; PartNumber: ABS07-32.768KHz-T; Q Value (Type): 30000; Operation Mode: Flexural Mode (Tuning Fork); Shunt Capacitance (C0): 0.9 to 1.2 pF; Load Capacitance (CL): 12.5 pF; Frequency Tolerance @+25degC: +/- 20 ppm; Drive Level (Type): 0.1 uW; Equivalent Series Resistance (R1): 70 Kohm; Insulation Resistance (Min): 500 Mohm; ComponentLink3URL: http://www.abracon.com/Resonators/ABS07.pdf; PackageDescription: 2-Pin Hand Drawn, Body 3.2x1.5mm, Pitch 2.5mm; Operating Temperature: -40 to 85 degC; ComponentLink2URL: http://www.abracon.com/Resonators/ABS07.pdf; PackageReference: ABS07-2; ComponentLink3Description: Package Specification; ComponentLink1Description: Manufacturer URL; DatasheetVersion: 04.03.13; Mounting Technology: Surface Mount; ComponentLink2Description: Datasheet; ComponentLink1URL: http://www.abracon.com/; Packing: Tape and Reel; Frequency: 32.768 kHz